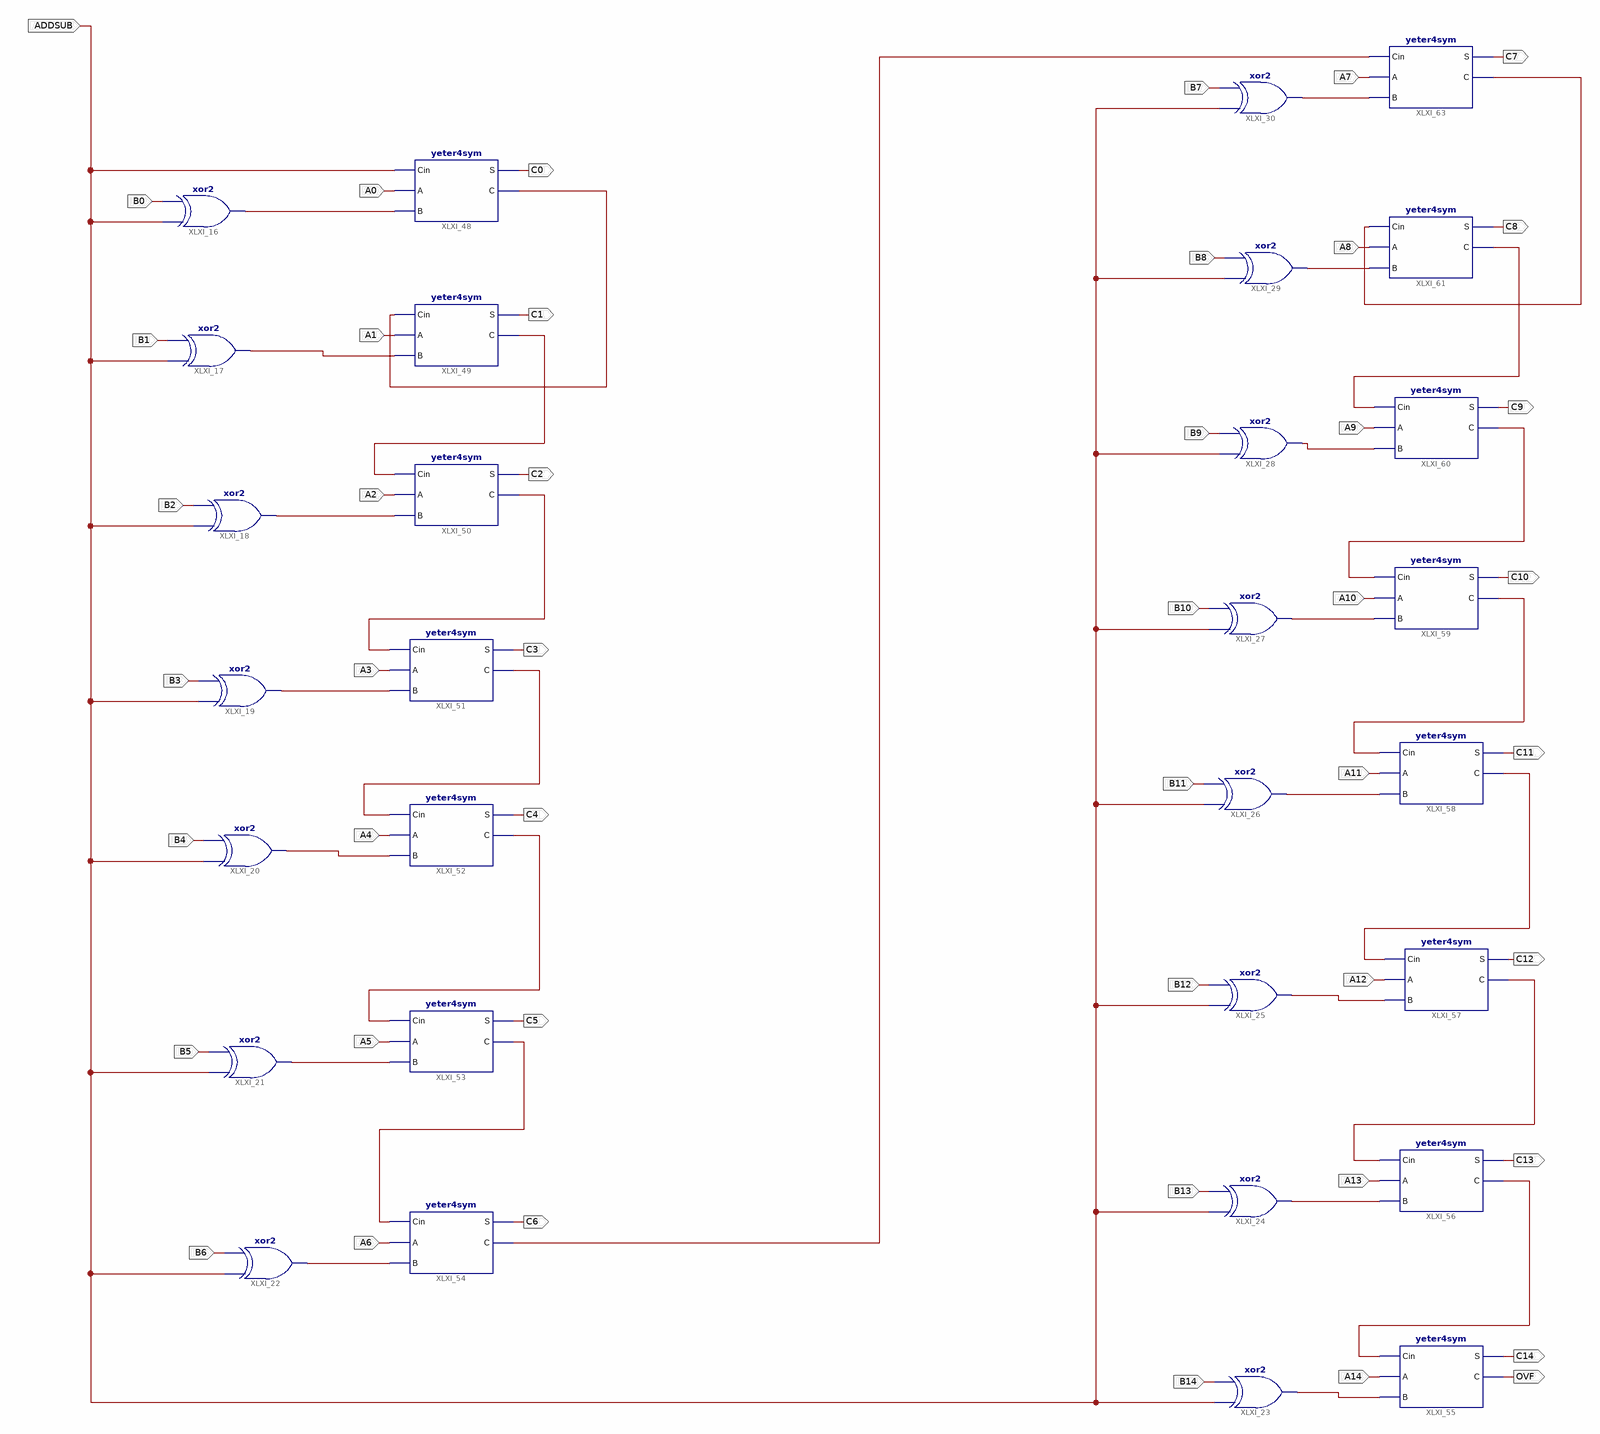
[diagram p0: schematic sheet 1]
// Xilinx ISE schematic yeter4.sch (spartan3e) as structural Verilog: 30 symbols, 47 ports
module yeter4 (
  input  B0,
  input  A0,
  input  A2,
  input  B2,
  input  B3,
  input  A3,
  input  B4,
  input  A4,
  input  B5,
  input  A5,
  input  A6,
  input  B6,
  input  B1,
  input  A1,
  input  B7,
  input  A7,
  input  A8,
  input  B8,
  input  A9,
  input  B9,
  input  A10,
  input  B10,
  input  A11,
  input  B11,
  input  A12,
  input  B12,
  input  A13,
  input  B13,
  input  A14,
  input  B14,
  input  ADDSUB,
  output C6,
  output C5,
  output C4,
  output C3,
  output C2,
  output C1,
  output C0,
  output C7,
  output C8,
  output C9,
  output C10,
  output C11,
  output C12,
  output C13,
  output C14,
  output OVF
);

  wire XLXN_1, XLXN_2, XLXN_3, XLXN_4, XLXN_5, XLXN_6, XLXN_7, XLXN_8, XLXN_9, XLXN_10, XLXN_11, XLXN_12,
       XLXN_13, XLXN_14, XLXN_15, XLXN_30, XLXN_64, XLXN_66, XLXN_68, XLXN_70, XLXN_72, XLXN_74, XLXN_76,
       XLXN_78, XLXN_80, XLXN_82, XLXN_84, XLXN_86, XLXN_91;

  xor XLXI_16 (XLXN_1, ADDSUB, B0);
  xor XLXI_17 (XLXN_2, ADDSUB, B1);
  xor XLXI_18 (XLXN_3, ADDSUB, B2);
  xor XLXI_19 (XLXN_4, ADDSUB, B3);
  xor XLXI_20 (XLXN_5, ADDSUB, B4);
  xor XLXI_21 (XLXN_6, ADDSUB, B5);
  xor XLXI_22 (XLXN_7, ADDSUB, B6);
  xor XLXI_23 (XLXN_8, ADDSUB, B14);
  xor XLXI_24 (XLXN_9, ADDSUB, B13);
  xor XLXI_25 (XLXN_10, ADDSUB, B12);
  xor XLXI_26 (XLXN_11, ADDSUB, B11);
  xor XLXI_27 (XLXN_12, ADDSUB, B10);
  xor XLXI_28 (XLXN_13, ADDSUB, B9);
  xor XLXI_29 (XLXN_14, ADDSUB, B8);
  xor XLXI_30 (XLXN_15, ADDSUB, B7);
  yeter4sym XLXI_48 (.A(A0), .B(XLXN_1), .C(XLXN_64), .Cin(ADDSUB), .S(C0));
  yeter4sym XLXI_49 (.A(A1), .B(XLXN_2), .C(XLXN_66), .Cin(XLXN_64), .S(C1));
  yeter4sym XLXI_50 (.A(A2), .B(XLXN_3), .C(XLXN_68), .Cin(XLXN_66), .S(C2));
  yeter4sym XLXI_51 (.A(A3), .B(XLXN_4), .C(XLXN_70), .Cin(XLXN_68), .S(C3));
  yeter4sym XLXI_52 (.A(A4), .B(XLXN_5), .C(XLXN_72), .Cin(XLXN_70), .S(C4));
  yeter4sym XLXI_53 (.A(A5), .B(XLXN_6), .C(XLXN_30), .Cin(XLXN_72), .S(C5));
  yeter4sym XLXI_54 (.A(A6), .B(XLXN_7), .C(XLXN_74), .Cin(XLXN_30), .S(C6));
  yeter4sym XLXI_55 (.A(A14), .B(XLXN_8), .C(OVF), .Cin(XLXN_86), .S(C14));
  yeter4sym XLXI_56 (.A(A13), .B(XLXN_9), .C(XLXN_86), .Cin(XLXN_91), .S(C13));
  yeter4sym XLXI_57 (.A(A12), .B(XLXN_10), .C(XLXN_91), .Cin(XLXN_82), .S(C12));
  yeter4sym XLXI_58 (.A(A11), .B(XLXN_11), .C(XLXN_82), .Cin(XLXN_84), .S(C11));
  yeter4sym XLXI_59 (.A(A10), .B(XLXN_12), .C(XLXN_84), .Cin(XLXN_78), .S(C10));
  yeter4sym XLXI_60 (.A(A9), .B(XLXN_13), .C(XLXN_78), .Cin(XLXN_80), .S(C9));
  yeter4sym XLXI_61 (.A(A8), .B(XLXN_14), .C(XLXN_80), .Cin(XLXN_76), .S(C8));
  yeter4sym XLXI_63 (.A(A7), .B(XLXN_15), .C(XLXN_76), .Cin(XLXN_74), .S(C7));
endmodule
